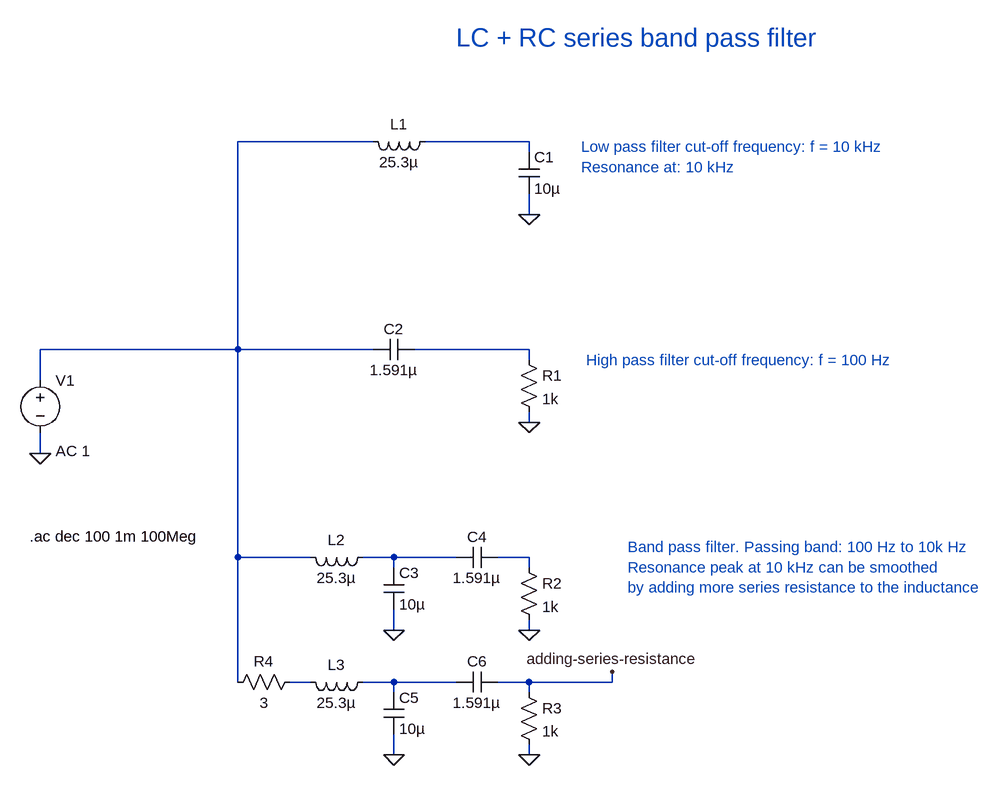
[diagram p0: schematic LC-and-RC-series- bandpass-filter.asc]
LC-and-RC-series- bandpass-filter.asc, the LTspice schematic file:
Version 4.1
SHEET 1 1660 1324
WIRE 240 -80 32 -80
WIRE 480 -80 320 -80
WIRE 480 -64 480 -80
WIRE 480 32 480 0
WIRE 32 240 32 -80
WIRE 32 240 -272 240
WIRE 240 240 32 240
WIRE 480 240 304 240
WIRE 480 256 480 240
WIRE -272 288 -272 240
WIRE 480 352 480 336
WIRE -272 400 -272 368
WIRE 32 560 32 240
WIRE 144 560 32 560
WIRE 272 560 224 560
WIRE 368 560 272 560
WIRE 480 560 432 560
WIRE 272 576 272 560
WIRE 480 576 480 560
WIRE 272 672 272 640
WIRE 480 672 480 656
WIRE 32 752 32 560
WIRE 144 752 112 752
WIRE 272 752 224 752
WIRE 368 752 272 752
WIRE 480 752 432 752
WIRE 608 752 608 736
WIRE 608 752 480 752
WIRE 272 768 272 752
WIRE 480 768 480 752
WIRE 272 864 272 832
WIRE 480 864 480 848
FLAG 480 32 0
FLAG 480 352 0
FLAG -272 400 0
FLAG 272 672 0
FLAG 480 672 0
FLAG 272 864 0
FLAG 480 864 0
FLAG 608 736 adding-series-resistance
SYMBOL ind 336 -96 R90
WINDOW 0 5 56 VBottom 2
WINDOW 3 32 56 VTop 2
SYMATTR InstName L1
SYMATTR Value 25.3µ
SYMBOL cap 464 -64 R0
SYMATTR InstName C1
SYMATTR Value 10µ
SYMBOL cap 304 224 R90
WINDOW 0 0 32 VBottom 2
WINDOW 3 32 32 VTop 2
SYMATTR InstName C2
SYMATTR Value 1.591µ
SYMBOL res 464 240 R0
SYMATTR InstName R1
SYMATTR Value 1k
SYMBOL voltage -272 272 R0
WINDOW 123 24 124 Left 2
WINDOW 39 0 0 Left 0
SYMATTR Value2 AC 1
SYMATTR InstName V1
SYMATTR Value ""
SYMBOL ind 240 544 R90
WINDOW 0 5 56 VBottom 2
WINDOW 3 32 56 VTop 2
SYMATTR InstName L2
SYMATTR Value 25.3µ
SYMATTR SpiceLine Rser=100m
SYMBOL cap 256 576 R0
SYMATTR InstName C3
SYMATTR Value 10µ
SYMBOL cap 432 544 R90
WINDOW 0 0 32 VBottom 2
WINDOW 3 32 32 VTop 2
SYMATTR InstName C4
SYMATTR Value 1.591µ
SYMBOL res 464 560 R0
SYMATTR InstName R2
SYMATTR Value 1k
SYMBOL ind 240 736 R90
WINDOW 0 5 56 VBottom 2
WINDOW 3 32 56 VTop 2
SYMATTR InstName L3
SYMATTR Value 25.3µ
SYMATTR SpiceLine Rser=100m
SYMBOL cap 256 768 R0
SYMATTR InstName C5
SYMATTR Value 10µ
SYMBOL cap 432 736 R90
WINDOW 0 0 32 VBottom 2
WINDOW 3 32 32 VTop 2
SYMATTR InstName C6
SYMATTR Value 1.591µ
SYMBOL res 464 752 R0
SYMATTR InstName R3
SYMATTR Value 1k
SYMBOL res 16 768 R270
WINDOW 0 32 56 VTop 2
WINDOW 3 0 56 VBottom 2
SYMATTR InstName R4
SYMATTR Value 3
TEXT -288 528 Left 2 !.ac dec 100 1m 100Meg
TEXT 560 -72 Left 2 ;Low pass filter cut-off frequency: f = 10 kHz\nResonance at: 10 kHz
TEXT 568 256 Left 2 ;High pass filter cut-off frequency: f = 100 Hz
TEXT 632 544 Left 2 ;Band pass filter. Passing band: 100 Hz to 10k Hz\nResonance peak at 10 kHz can be smoothed \nby adding more series resistance to the inductance
TEXT 368 -240 Left 4 ;LC + RC series band pass filter

The netlist it stands for:
* LC-and-RC-series- bandpass-filter.asc
L1 N002 N001 25.3µ
C1 N002 0 10µ
C2 N003 N001 1.591µ
R1 N003 0 1k
V1 N001 0 AC 1
L2 N004 N001 25.3µ Rser=100m
C3 N004 0 10µ
C4 N005 N004 1.591µ
R2 N005 0 1k
L3 N007 N006 25.3µ Rser=100m
C5 N007 0 10µ
C6 adding-series-resistance N007 1.591µ
R3 adding-series-resistance 0 1k
R4 N001 N006 3
.ac dec 100 1m 100Meg
* Low pass filter cut-off frequency: f = 10 kHz
* Resonance at: 10 kHz
* High pass filter cut-off frequency: f = 100 Hz
* Band pass filter. Passing band: 100 Hz to 10k Hz
* Resonance peak at 10 kHz can be smoothed
* by adding more series resistance to the inductance
* LC + RC series band pass filter
.backanno
.end